# Altium schematic sheet LocalizationBoard_B_1.0_Schematic_CG.SchDoc
size B
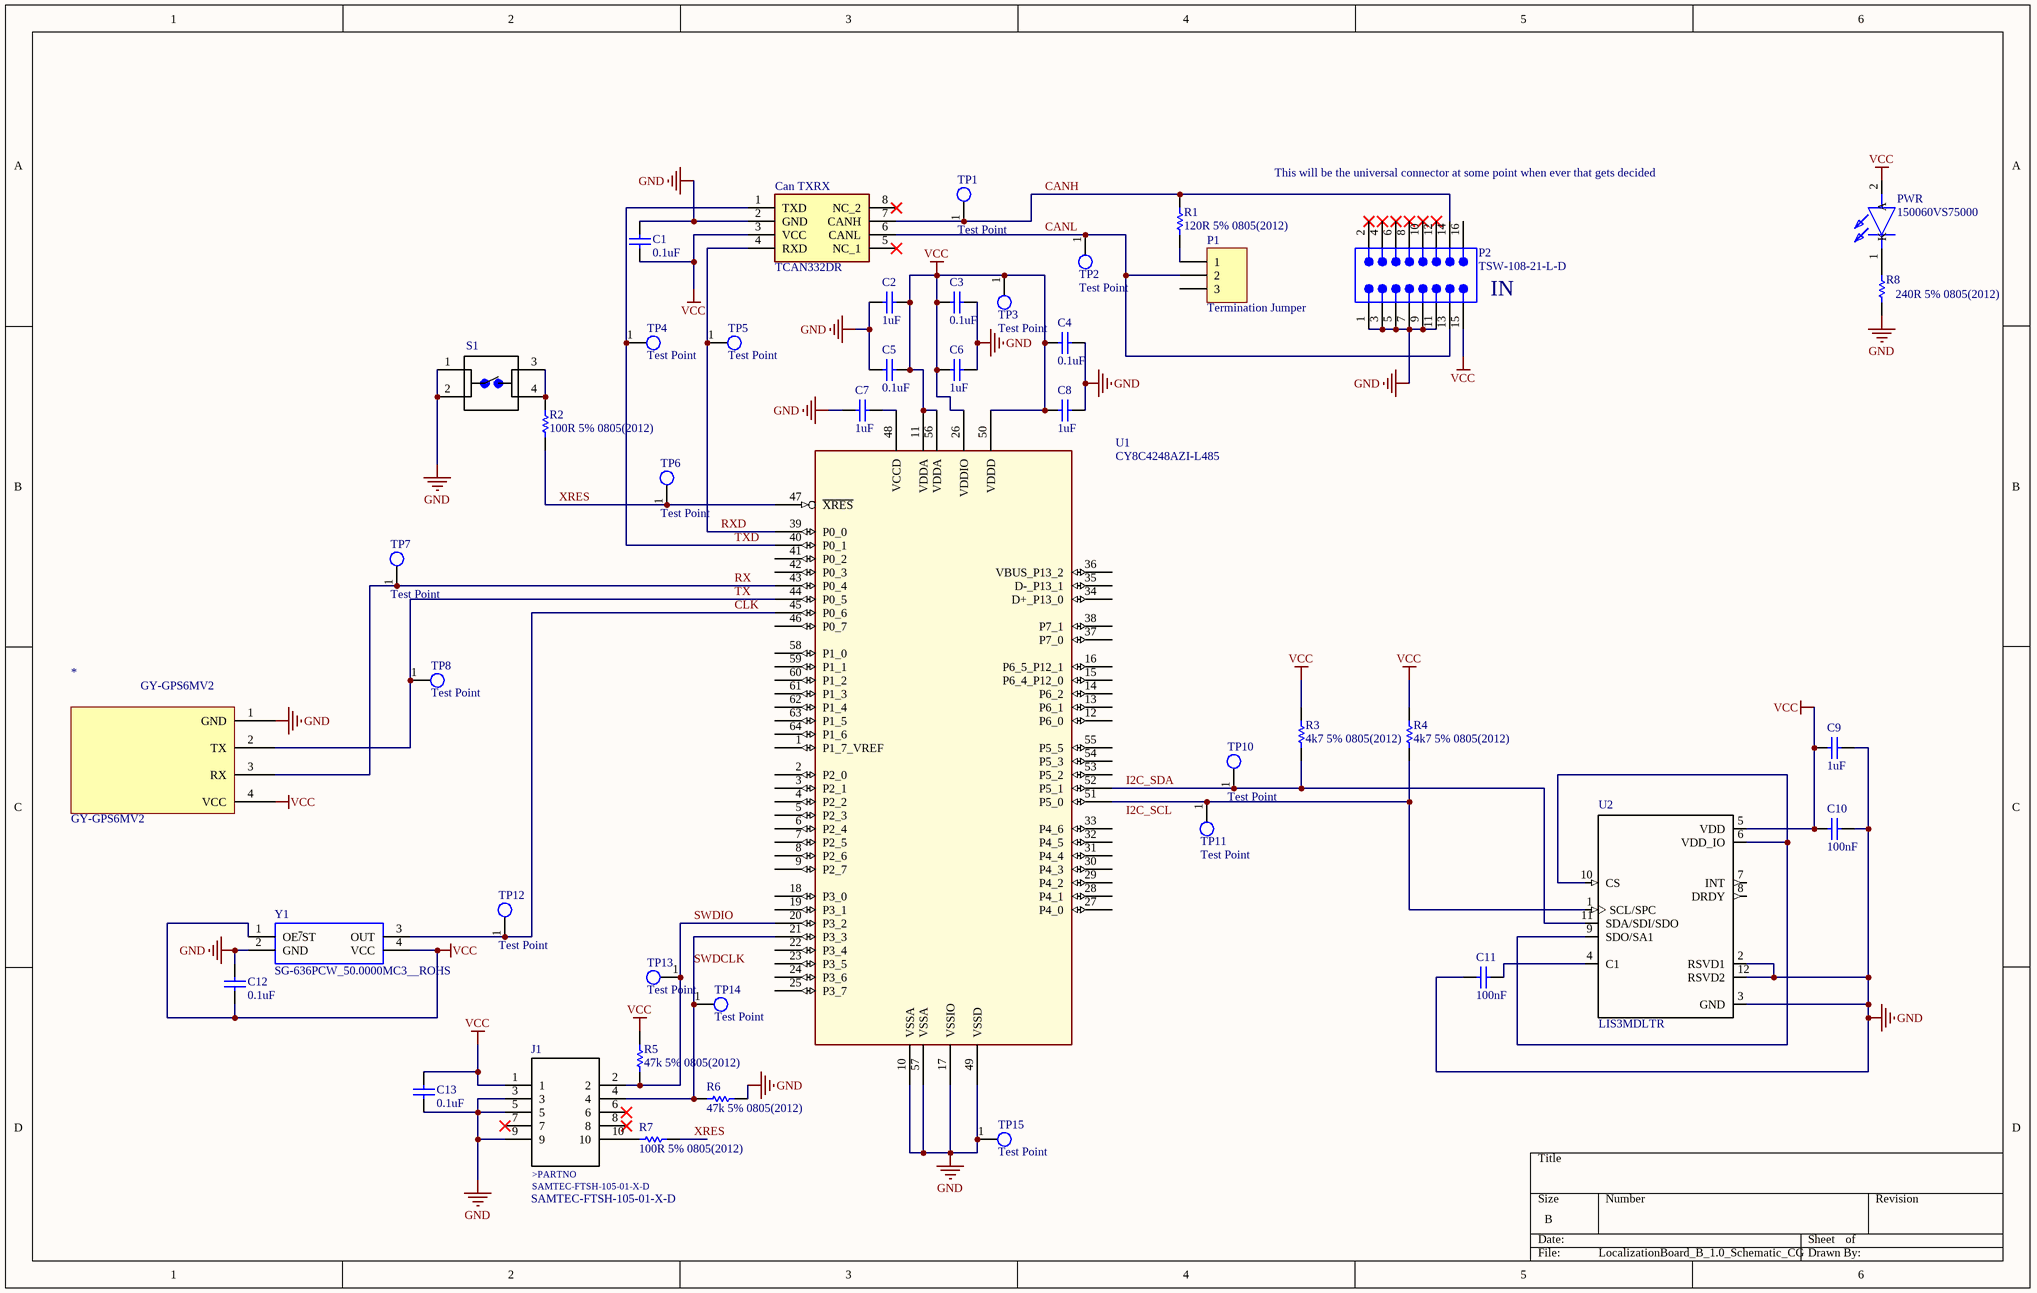
[diagram p0: LocalizationBoard_B_1.0_Schematic_CG.SchDoc]

## Parts
*  GY-GPS6MV2  [PCBComponent_1 - duplicate2]
C1  0.1uF  [CAPC0805(2012)100_M]
C2  1uF  [CAPC0805(2012)100_M]
C3  0.1uF  [CAPC0805(2012)100_M]
C4  0.1uF  [CAPC0805(2012)100_N]
C5  0.1uF  [CAPC0805(2012)100_M]
C6  1uF  [CAPC0805(2012)100_M]
C7  1uF  [CAPC0805(2012)100_M]
C8  1uF  [CAPC0805(2012)100_M]
C9  1uF  [CAPC0805(2012)100_M]
C10  100nF  [CAPC0805(2012)100_M]
C11  100nF  [CAPC0805(2012)100_M]
C12  0.1uF  [CAPC0805(2012)100_M]
C13  0.1uF  [CAPC0805(2012)100_M]
Can_TXRX  TCAN332DR  [SOIC127P600X175-8N]
J1  SAMTEC-FTSH-105-01-X-D  [SAMTEC-FTSH-105-01-X-D]
P1  Termination Jumper  [HDR1X3]
P2  TSW-108-21-L-D  [SMTC-TSW-108-21-X-D]
PWR  150060VS75000  [LEDC1608X80N]
R1  120R 5% 0805(2012)  [RESC0805(2012)_N]
R2  100R 5% 0805(2012)  [RESC0805(2012)_N]
R3  4k7 5% 0805(2012)  [RESC0805(2012)_N]
R4  4k7 5% 0805(2012)  [RESC0805(2012)_N]
R5  47k 5% 0805(2012)  [RESC0805(2012)_N]
R6  47k 5% 0805(2012)  [RESC0805(2012)_N]
R7  100R 5% 0805(2012)  [RESC0805(2012)_N]
R8  240R 5% 0805(2012)  [RESC0805(2012)_N]
S1  1825910-7  [Switch 6mm 24V (NO)]  (value not drawn)
TP1  Test Point  [Test Point Through-hole]
TP2  Test Point  [Test Point Through-hole]
TP3  Test Point  [Test Point Through-hole]
TP4  Test Point  [Test Point Through-hole]
TP5  Test Point  [Test Point Through-hole]
TP6  Test Point  [Test Point Through-hole]
TP7  Test Point  [Test Point Through-hole]
TP8  Test Point  [Test Point Through-hole]
TP10  Test Point  [Test Point Through-hole]
TP11  Test Point  [Test Point Through-hole]
TP12  Test Point  [Test Point Through-hole]
TP13  Test Point  [Test Point Through-hole]
TP14  Test Point  [Test Point Through-hole]
TP15  Test Point  [Test Point Through-hole]
U1  CY8C4248AZI-L485  [TQFP50P1200X1200X160-64N]
U2  LIS3MDLTR  [*XDCR_LIS3MDLTR]
Y1  SG-636PCW_50.0000MC3__ROHS  [SG-636]

## Nets
GND: *.1(GND) C1.1 C2.2 C3.1 C4.1 C5.2 C6.1 C7.2 C8.1 C9.1 C10.1 C11.2 C12.1 C13.2 Can_TXRX.2(GND) J1.3 J1.5 J1.9 P2.1 P2.3 P2.5 P2.7 P2.9 P2.11 R6.2 R8.1 S1.1 S1.2 TP15.1 U1.10(VSSA) U1.17(VSSIO) U1.49(VSSD) U1.57(VSSA) U2.2(RSVD1) U2.3(GND) U2.12(RSVD2) Y1.2(GND)
VCC: *.4(VCC) C1.2 C2.1 C3.2 C4.2 C5.1 C6.2 C8.2 C9.2 C10.2 C12.2 C13.1 Can_TXRX.3(VCC) J1.1 P2.15 PWR.2(A) R3.2 R4.2 R5.2 TP3.1 U1.11(VDDA) U1.26(VDDIO) U1.50(VDDD) U1.56(VDDA) U2.5(VDD) Y1.1(OE~{/}ST) Y1.4(VCC)
CANH: Can_TXRX.7(CANH) P2.14 R1.2 TP1.1
CANL: Can_TXRX.6(CANL) P1.2 P2.13 TP2.1
CLK: TP12.1 U1.45(P0_6) Y1.3(OUT)
I2C_SCL: R4.1 TP11.1 U1.51(P5_0) U2.1(SCL/SPC)
I2C_SDA: R3.1 TP10.1 U1.52(P5_1) U2.11(SDA/SDI/SDO)
RX: *.3(RX) TP7.1 U1.43(P0_4)
RXD: Can_TXRX.4(RXD) TP5.1 U1.39(P0_0)
SWDCLK: J1.4 R6.1 TP14.1 U1.21(P3_3)
SWDIO: J1.2 R5.1 TP13.1 U1.20(P3_2)
TX: *.2(TX) TP8.1 U1.44(P0_5)
TXD: Can_TXRX.1(TXD) TP4.1 U1.40(P0_1)
XRES: R2.1 R7.1 TP6.1 U1.47(~{XRES})
NetC7_1: C7.1 U1.48(VCCD)
NetC11_1: C11.1 U2.4(C1)
NetJ1_10: J1.10 R7.2
NetP1_1: P1.1 R1.1
NetPWR_1: PWR.1(K) R8.2
NetR2_2: R2.2 S1.3 S1.4
NetU2_6: U2.6(VDD_IO) U2.9(SDO/SA1) U2.10(CS)

Not connected (* = marked no-connect by the designer): Can_TXRX 5(NC_1)* 8(NC_2)*; J1 6* 7* 8*; P1 3; P2 2* 4* 6* 8* 10* 12* 16; U1 1(P1_7_VREF) 2(P2_0) 3(P2_1) 4(P2_2) 5(P2_3) 6(P2_4) 7(P2_5) 8(P2_6) 9(P2_7) 12(P6_0) 13(P6_1) 14(P6_2) 15(P6_4_P12_0) 16(P6_5_P12_1) 18(P3_0) 19(P3_1) 22(P3_4) 23(P3_5) 24(P3_6) 25(P3_7) 27(P4_0) 28(P4_1) 29(P4_2) 30(P4_3) 31(P4_4) 32(P4_5) 33(P4_6) 34(D+_P13_0) 35(D-_P13_1) 36(VBUS_P13_2) 37(P7_0) 38(P7_1) 41(P0_2) 42(P0_3) 46(P0_7) 53(P5_2) 54(P5_3) 55(P5_5) 58(P1_0) 59(P1_1) 60(P1_2) 61(P1_3) 62(P1_4) 63(P1_5) 64(P1_6); U2 7(INT) 8(DRDY)

## Notes on the sheet
- This will be the universal connector at some point when ever that gets decided
- (near P2) IN
- (in symbol SAMTEC-FTSH-105-01-X-D) >PARTNO

## Library data of the parts
C1-C13 = CMP-1036-01451-1: CAP 33pF 200V ±1% 0805 (2012 Metric) Thickness 1mm SMD; Tolerance: Â±1%; Case-EIA: 0805; Case-Metric: 2012; Technology: SMT; Rated Voltage: 200 V; Max Thickness: 1 mm; Value: 33pF
Can_TXRX = TCAN332DR: Integrated Circuit; Manufacturer_Name: Texas Instruments; Datasheet Link: http://www.ti.com/lit/ds/symlink/tcan332.pdf; Height: 1.75mm; Mouser Part Number: 595-TCAN332DR; Mouser Price/Stock: https://www.mouser.com/Search/Refine.aspx?Keyword=595-TCAN332DR; Manufacturer_Part_Number: TCAN332DR
P1 = Header 3: Header, 3-Pin; LatestRevisionDate: 17-Jul-2002; LatestRevisionNote: Re-released for DXP Platform.; Publisher: Altium Limited
P2 = CMP-1024-00418-1: Manufacturer: Samtec; Pitch: 2.54 mm; PartNumber: TSW-108-21-L-D; ComponentLink3URL: http://www.samtec.com/documents/webfiles/cpdf/TSW-XXX-XX-XXX-X-XX-XXX-MKT.pdf; PackageVersion: DM, 8/1988; ComponentLink1Description: Manufacturer URL; ComponentLink2Description: Datasheet; ComponentLink2URL: http://www.samtec.com/documents/webfiles/pdf/TSW_TH.PDF; ComponentLink1URL: http://www.samtec.com; DatasheetVersion: F-214; Orientation: Vertical; RoHS: True; PackageDescription: .025[0.64] SQ. Post Terminal Strip Assembly; Temperature Range: -55 to 125 degC; PackageReference: TSW-108-21-X-D; Mounting Technology: Through-hole; ComponentLink3Description: Package Specification
PWR = 150060VS75000: LED; Manufacturer_Name: Wurth Elektronik; Datasheet Link: http://docs-emea.rs-online.com/webdocs/1302/0900766b81302e1e.pdf; Height: 0.8mm; Manufacturer_Part_Number: 150060VS75000; Mouser Part Number: 710-150060VS75000; Mouser Price/Stock: https://www.mouser.com/Search/Refine.aspx?Keyword=710-150060VS75000; RS Part Number: 8154215P; RS Price/Stock: http://uk.rs-online.com/web/p/products/8154215P
R1-R8 = 120R 5% 0805: 120R 0.125W 5% 0805 (2012 Metric)  SMD; Case-Metric: 2012; Value: 120.00 Ohm; Case-EIA: 0805; Tolerance: 5 %; Technology: SMT; Power: 0.125 W
S1 = Switch 6mm 24V (NO): FSM4JAH=6MM TACT SWITCH, HIGH TEMP; MF: TE Connectivity; Contact_Current_Rating: 50 mA; Configuration_Pole-Throw: Single Pole - Single Throw; Package: None; Digi-Key_Part_Number: 450-1804-ND; Digi-Key_Purchase_URL: https://www.digikey.com/product-detail/en/te-connectivity-alcoswitch-switches/1825910-7/450-1804-ND/1731414?utm_source=snapeda&utm_medium=aggregator&utm_campaign=symbol; MP: 1825910-7; SnapEDA_Link: https://www.snapeda.com/parts/1825910-7/TE%20Connectivity%20ALCOSWITCH%20Switches/view-part/?ref=snap; EU_RoHS_Compliance: Compliant; TE_purchase_URL: https://www.te.com/usa-en/product-1825910-7.html?te_bu=Cor&te_type=disp&te_campaign=seda_glo_cor-seda-global-disp-prtnr-fy19-seda-model-bom-cta_sma-317_1&elqCampaignId=32493; Value: *
U2 = LIS3MDLTR: / LIS3MDL Series 3 Axis Â±2/Â±8/Â±12/Â±16 g 3.6V High Performance Magnetometer LGA-12 /; MF: STMicroelectronics; Package: VFLGA-12 STMicroelectronics; Digi-Key_Part_Number: 497-13892-1-ND; MP: LIS3MDLTR; Digi-Key_Purchase_URL: https://www.digikey.com/product-detail/en/stmicroelectronics/LIS3MDLTR/497-13892-1-ND/4309737?utm_source=snapeda&utm_medium=aggregator&utm_campaign=symbol; SnapEDA_Link: https://www.snapeda.com/parts/LIS3MDLTR/STMicroelectronics/view-part/?ref=snap; Value: *
Y1 = SG-636: Standard Clock Oscillators 50MHz 3.3Volt 100ppm -20C +70C; Manufacturer_Name: Epson Timing; Manufacturer_Part_Number: SG-636PCW 50.0000MC3: ROHS; RS Part Number: *; RS Price/Stock: *; Arrow Part Number: SG-636PCW 50.0000MC3: ROHS; Arrow Price/Stock: *; Datasheet Link: http://www.mouser.com/ds/2/137/G-636PCE_en-1003252.pdf
U1 = CY8C4248AZI-L485: Part_Number: CY8C4248AZI-L485